# EAGLE design cheapskate_daughter (EAGLE 5.02)
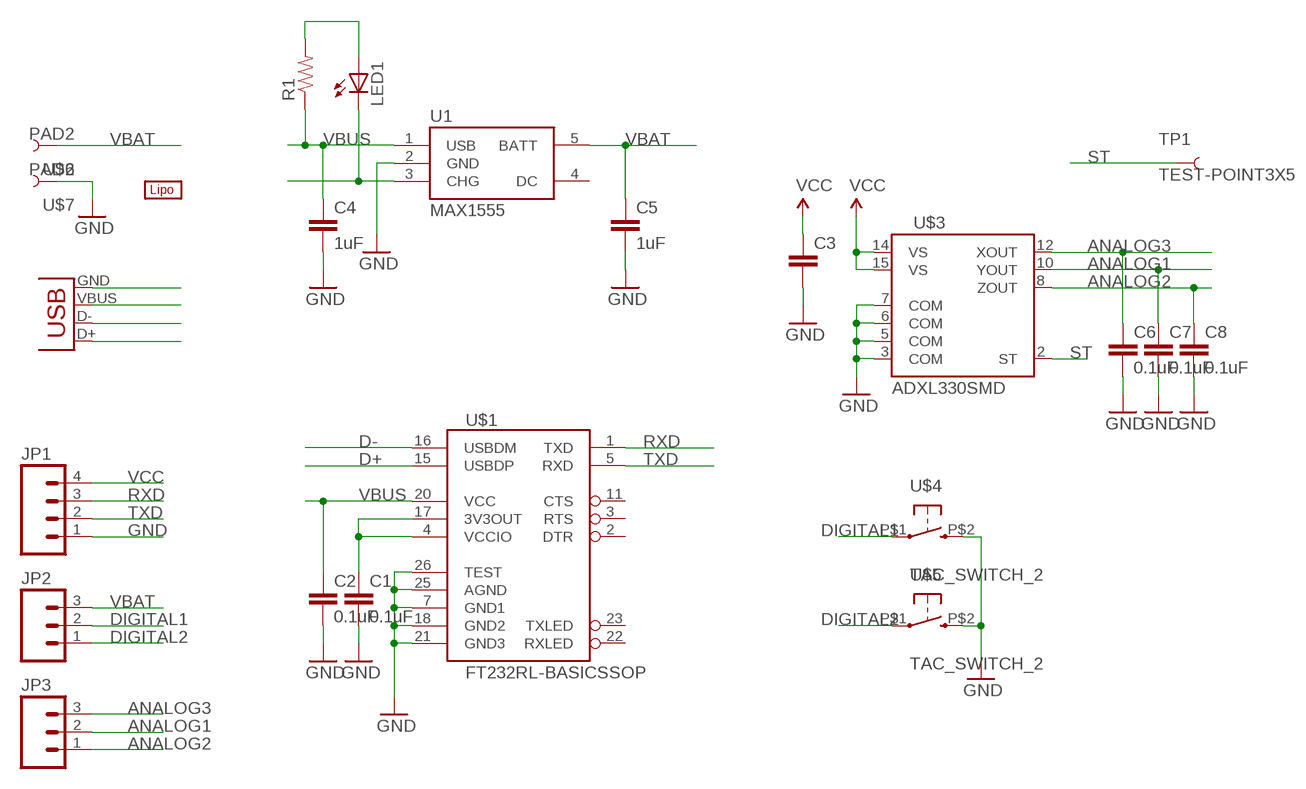
[diagram p0: schematic, sheet 1]

## Parts
C1  0.1uF  CAP0603  [0603]
C2  0.1uF  CAP0603  [0603]
C3  CAP0603  [0603]
C4  1uF  CAP0603  [0603]
C5  1uF  CAP0603  [0603]
C6  0.1uF  CAP0603  [0603]
C7  0.1uF  CAP0603  [0603]
C8  0.1uF  CAP0603  [0603]
JP1  M04PTH  [1X04]
JP2  M03PTH  [1X03]
JP3  M03PTH  [1X03]
LED1  LED0603  [LED-0603]
R1  RESISTOR0603  [0603]
TP1  TEST-POINT3X5  [PAD.03X.05]
U1  MAX1555  [SOT23-5]
U$1  FT232RL-BASICSSOP  [SSOP28DB]
U$2  LIPO-OUTLINE100  [LIPO-100]
U$3  ADXL330SMD  [LFCSP-16]
U$4  TAC_SWITCH_2  [KSS231GLFS]
U$5  TAC_SWITCH_2  [KSS231GLFS]
U$6  PAD2  [PAD-3MMX3MM]
U$7  PAD2  [PAD-3MMX3MM]
X1  USBSMD  [USB-MINIB]

## Nets
ANALOG1: C7.1 JP3.2 U$3.10(YOUT)
ANALOG2: C8.1 JP3.1 U$3.8(ZOUT)
ANALOG3: C6.1 JP3.3 U$3.12(XOUT)
D+: U$1.15(USBDP) X1.D+
D-: U$1.16(USBDM) X1.D-
DIGITAL1: JP2.2 U$4.P$1
DIGITAL2: JP2.1 U$5.P$1
GND: C1.2 C2.2 C3.2 C4.2 C5.2 C6.2 C7.2 C8.2 JP1.1 U1.2(GND) U$1.7(GND1) U$1.18(GND2) U$1.21(GND3) U$1.25(AGND) U$1.26(TEST) U$3.3(COM) U$3.5(COM) U$3.6(COM) U$3.7(COM) U$4.P$2 U$5.P$2 U$7.P$1 X1.GND
N$1: LED1.C U1.3(CHG)
N$2: C1.1 U$1.4(VCCIO) U$1.17(3V3OUT)
N$3: LED1.A R1.2
RXD: JP1.3 U$1.1(TXD)
ST: TP1.P$1 U$3.2(ST)
TXD: JP1.2 U$1.5(RXD)
VBAT: C5.1 JP2.3 U1.5(BATT) U$6.P$1
VBUS: C2.1 C4.1 R1.1 U1.1(USB) U$1.20(VCC) X1.VBUS
VCC: C3.1 JP1.4 U$3.14(VS) U$3.15(VS)
Unconnected: U1.4(DC) U$1.2(DTR) U$1.3(RTS) U$1.11(CTS) U$1.22(RXLED) U$1.23(TXLED)

## Library data of the parts
C1-C8 = SparkFun:CAP: Capacitor Standard 0603 ceramic capacitor, and 0.1" leaded capacitor.
JP1 = SparkFun:M04: Header 4 Standard 4-pin 0.1" header. Use with straight break away headers (SKU : PRT-00116), right angle break away headers (PRT-00553), swiss pins (PRT-00743), machine pins (PRT-00117), and female headers (PRT-00115). Molex polarized connector foot print use with SKU : PRT-08231 with associated crimp pins and housings.
JP2 JP3 = SparkFun:M03: Header 3 Standard 3-pin 0.1" header. Use with straight break away headers (SKU : PRT-00116), right angle break away headers (PRT-00553), swiss pins (PRT-00743), machine pins (PRT-00117), and female headers (PRT-00115). Molex polarized connector foot print use with SKU : PRT-08232 with associated crimp pins and housings.
LED1 = SparkFun:LED: LEDs Standard schematic elements and footprints for 5mm, 3mm, 1206, and 0603 sized LEDs. 5mm - Spark Fun Electronics SKU : COM-00529 (and others)
R1 = SparkFun:RESISTOR: Resistor Basic schematic elements and footprints for 0603, 1206, and PTH 1/10th watt (small) resistors.
TP1 = SparkFun:TEST-POINT
U1 = SparkFun:MAX1555: MAX1555 Lithium Charger IC SOT-23 Lithium Polymer charging IC. Schematic element and footprint proven. Spark Fun Electronics SKU : COM-00674
U$1 = SparkFun:FT232RL-BASIC: USB UART This is the simplified version of the FT232RL unit. Only what you need, nothing you don't. Spark Fun Electronics SKU : COM-00650
U$2 = SparkFun:LIPO-OUTLINE
U$3 = SparkFun:ADXL330: Triple Axis Accelerometer Analog Devices ADXL330 +/-3g 2.4V-5.25V Analog output. Spark Fun Electronics SKU : COM-00730. Center pad paste layer has been reduced to avoid shorting.
U$4 U$5 = john:TAC_SWITCH_2
U$6 U$7 = john:PAD2
X1 = SparkFun:USB: USB Connectors USB-B-PTH is fully proven SKU : PRT-00139 USB-miniB is fully proven SKU : PRT-00587 USB-A-PCB is untested. USB-A-H is throughly reviewed, but untested. Spark Fun Electronics SKU : PRT-00437 USB-B-SMT is throughly reviewed, but untested. Needs silkscreen touching up. USB-A-S has not been used/tested USB-MB-H has not been used/tested

## Board
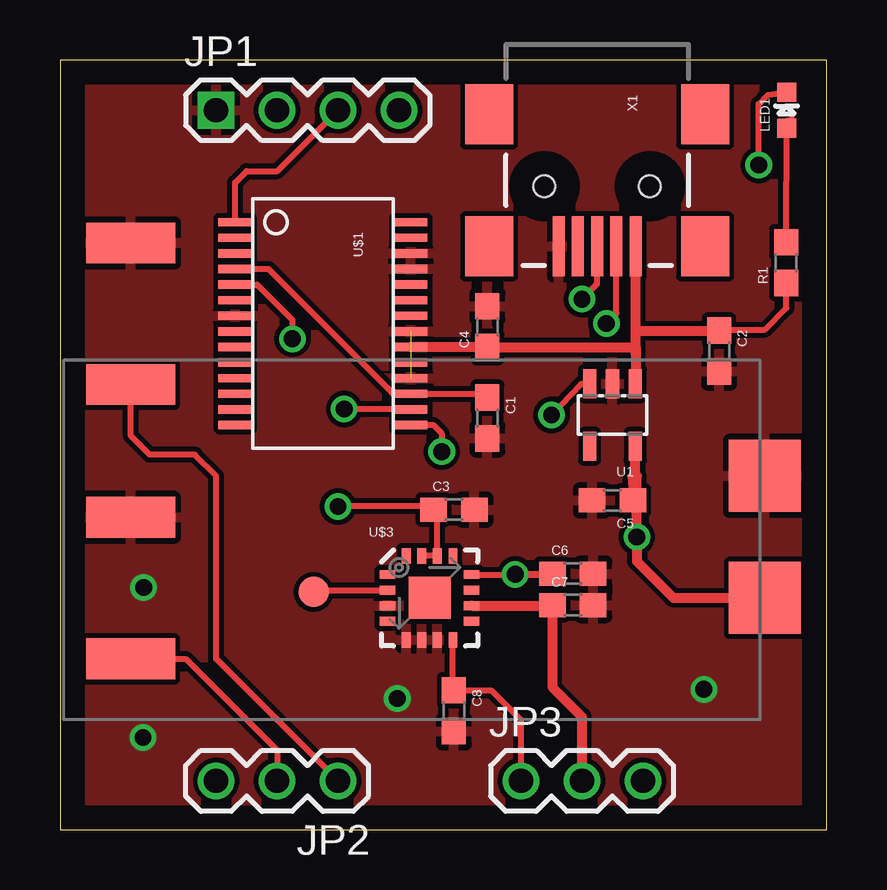
[diagram p1: board, top side]
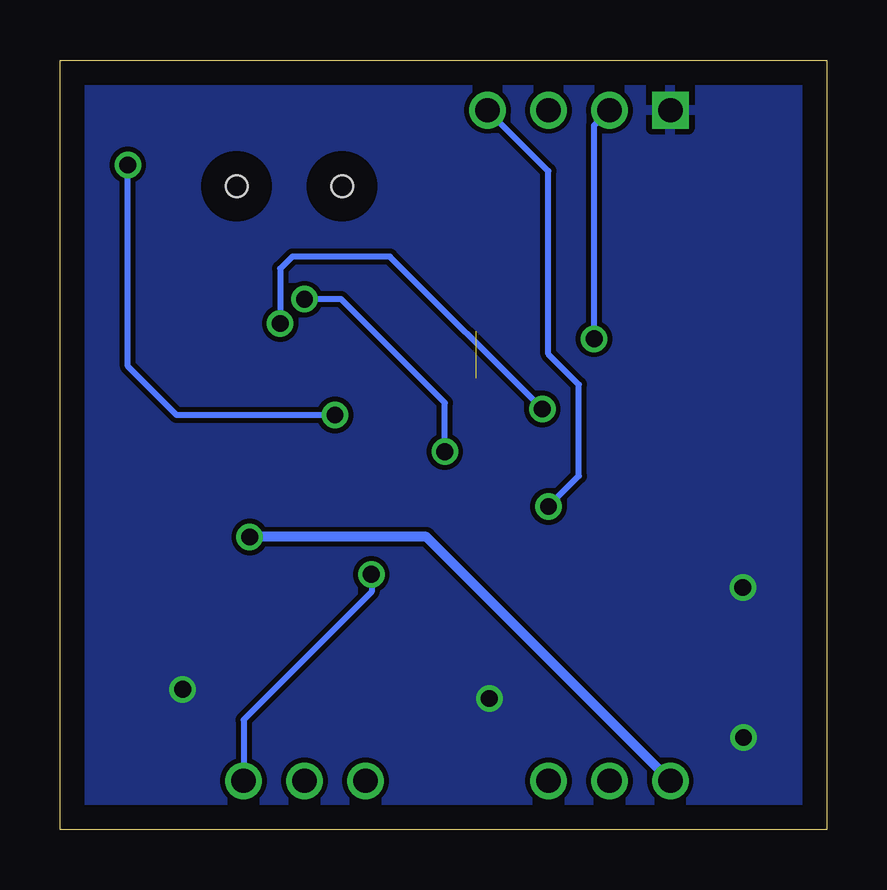
[diagram p2: board, bottom side, seen from below]

Size 31.94 x 32.08 mm. Coordinates in mm from the lower left corner, seen from the top.
Outline: 0,0 31.94,0 31.94,32.08 0,32.08 0,0
Copper layers (1*16): Top 0.035mm / dielectric 1.5mm / Bottom 0.035mm
Design rules "default": minimum track width 10mil, minimum drill 24mil, track to track 8mil, track to pad 8mil, pad to pad 8mil, via to via 8mil, smd to smd 8mil, copper to edge 40mil, drill to drill 8mil, minimum pad ring 10mil, minimum via ring 8mil, stop-mask expansion 4mil, vias tented up to drill 0mil, thermal gap 10mil

### Footprints (pad centres in the part's own frame; a part is rotated, then mirrored left to right if it is on the bottom)
0603 = smd 1.1 x 1: 1 -0.85,0; 2 0.85,0
1X04 = drill 1.016 square: 1 0,0 | drill 1.016 round: 2 2.54,0; 3 5.08,0; 4 7.62,0
1X03 = drill 1.016 round: 1 0,0; 2 2.54,0; 3 5.08,0
LED-0603 = smd 0.8 x 0.8: A 0,-0.75; C 0,0.75
PAD.03X.05 = smd 1.27 x 1.27: P$1 0,0
SOT23-5 = smd 0.55 x 1.2: 1 -0.95,-1.3; 2 0,-1.3; 3 0.95,-1.3; 4 0.95,1.3; 5 -0.95,1.3
SSOP28DB = smd 0.348 x 1.397: 1 -4.225,-3.656; 2 -3.575,-3.656; 3 -2.925,-3.656; 4 -2.275,-3.656; 5 -1.625,-3.656; 6 -0.975,-3.656; 7 -0.325,-3.656; 8 0.325,-3.656; 9 0.975,-3.656; 10 1.625,-3.656; 11 2.275,-3.656; 12 2.925,-3.656; 13 3.575,-3.656; 14 4.225,-3.656; 15 4.225,3.656; 16 3.575,3.656; 17 2.925,3.656; 18 2.275,3.656; 19 1.625,3.656; 20 0.975,3.656; 21 0.325,3.656; 22 -0.325,3.656; 23 -0.975,3.656; 24 -1.625,3.656; 25 -2.275,3.656; 26 -2.925,3.656; 27 -3.575,3.656; 28 -4.225,3.656
LFCSP-16 = smd 1.75 x 1.75: 0 0,0 | smd 0.65 x 0.37: 1 -1.75,0.975; 2 -1.75,0.325; 3 -1.75,-0.325; 4 -1.75,-0.975; 9 1.75,-0.975; 10 1.75,-0.325; 11 1.75,0.325; 12 1.75,0.975 | smd 0.37 x 0.65: 5 -0.975,-1.75; 6 -0.325,-1.75; 7 0.325,-1.75; 8 0.975,-1.75; 13 0.975,1.75; 14 0.325,1.75; 15 -0.325,1.75; 16 -0.975,1.75
KSS231GLFS = smd 1.7 x 3.7: P$1 0,0; P$2 5.9,0
PAD-3MMX3MM = smd 3 x 3: P$1 0,0
USB-MINIB = smd 2.5 x 0.5: D+ 2.5,0; D- 2.5,0.8; GND 2.5,-1.6; ID 2.5,-0.8; VBUS 2.5,1.6 | smd 2.5 x 2: GND@1 -3,-4.5; GND@2 -3,4.5; GND@3 2.5,4.5; GND@4 2.5,-4.5 | hole 0.9: 0,2.2; 0,-2.2

### Placement (x,y rotation side)
C1  17.81,17.16 270 top
C2  27.46,19.95 270 top
C3  16.41,13.35 0 top
C4  17.81,20.97 90 top
C5  23.02,13.73 180 top
C6  21.37,10.68 0 top
C7  21.37,9.36 0 top
C8  16.41,4.96 270 top
JP1  6.51,29.98 0 top
JP2  11.59,2.04 180 top
JP3  19.21,2.04 0 top
LED1  30.28,29.98 0 top
R1  30.26,23.63 90 top
TP1  10.57,9.92 0 top
U1  23.02,17.28 180 top
U$1  10.95,21.09 270 top
U$2  0.16,4.58 0 top
U$3  15.4,9.66 0 top
U$4  2.95,7.12 90 top
U$5  2.95,18.55 90 top
U$6  29.37,9.66 0 top
U$7  29.37,14.74 0 top
X1  22.38,26.81 270 top

### Tracks (layer width: path | path; a pad name or v marks a point on that pad's centre or on a via)
ANALOG1
  Top 0.406: 20.55,9.36 20.55,9.38 | 20.55,9.36 C7.1 20.52,5.94 21.75,4.71 21.75,2.09 21.77,2.07 JP3.2 | U$3.10 20.55,9.34 20.55,9.36
ANALOG2
  Top 0.254: U$3.8 16.37,5.89 16.41,5.85 C8.1 17.98,5.81 19.21,4.58 JP3.1
ANALOG3  (via drill 0.7)
  Top 0.254: C6.1 20.48,10.68 20.44,10.64 U$3.12 | 20.46,10.64 v18.97,10.64
  Top 0.406: C6.1 20.5,10.68 20.46,10.64
  Bottom 0.254: JP3.3 24.29,4.58 18.95,9.92 v18.97,10.64
D+  (via drill 0.7)
  Top 0.254: X1.D+ 22.38,22.74 v21.75,22.11 | U$1.15 15.56,16.87 15.91,16.52 v15.91,15.76
  Bottom 0.254: v15.91,15.76 15.91,17.79 20.22,22.11 v21.75,22.11
D-  (via drill 0.7)
  Top 0.254: X1.D- 23.18,21.51 v22.76,21.09 | U$1.16 14.64,17.54 v11.84,17.54
  Bottom 0.254: v22.76,21.09 22.76,23.38 22.26,23.89 18.19,23.89 v11.84,17.54
DIGITAL1
  Top 0.254: JP2.2 9.05,3.31 5.24,7.12 U$4.P$1
DIGITAL2
  Top 0.254: JP2.1 6.51,7.12 6.51,14.74 5.62,15.63 3.74,15.63 2.95,16.42 U$5.P$1
GND  (via drill 0.7)  (1 unrouted)
  other vias: 3.48,10.09 14.05,5.47 26.83,5.85 3.46,3.85
  pour Top: 0.03,32.01 0.03,0.01 31.91,0.01 31.91,32.01
  pour Bottom: 0.16,32.01 31.65,32.01 31.65,0.26 0.16,0.26
N$1  (via drill 0.7)
  Top 0.254: U1.3 21.72,18.58 v20.48,17.28 | LED1.C 29.49,30.62 29.11,30.24 v29.11,27.7
  Bottom 0.254: v20.48,17.28 27.08,17.28 29.11,19.31 v29.11,27.7
N$2
  Top 0.254: U$1.4 8.68,23.37 13.88,18.17 U$1.17 17.81,18.17 | 17.81,18.17 17.94,18.3 | 17.81,18.17 C1.1
N$3
  Top 0.254: LED1.A 30.5,29.61 30.28,29.54 R1.2
RXD
  Top 0.254: U$1.1 7.3,26.96 7.78,27.44 9.05,27.44 JP1.3
ST
  Top 0.254: U$3.2 10.64,9.99 TP1.P$1
TXD  (via drill 0.7)
  Top 0.254: U$1.5 8.21,22.72 9.68,21.25 v9.68,20.46
  Bottom 0.254: v9.68,20.46 9.68,29.35 JP1.2
VBAT  (via drill 0.7)
  Top 0.254: 23.97,14.93 23.78,14.74 C5.1 24.03,14.74
  Top 0.406: 23.97,14.93 U1.5 | 24.03,14.74 v24.03,12.2 24.03,11.19 25.56,9.66 U$6.P$1
  Bottom 0.406: v24.03,12.2 16.67,12.2 JP2.3
VBUS
  Top 0.254: 23.98,19.87 23.98,19.85 24.03,19.82 | 30.64,22.87 R1.1 30.26,21.75 29.37,20.84 27.59,20.84 27.55,20.8 C2.1 | 23.98,20.84 24.03,20.84 24.07,20.8
  Top 0.406: 23.98,20.13 23.98,19.87 | 23.98,20.13 23.98,20.84 X1.VBUS | 24.07,20.8 C2.1 | 23.98,18.58 U1.1 | 23.98,19.85 23.98,18.58 | 23.98,18.58 24.03,18.55 | 17.91,20.12 17.91,20.11 | 17.91,20.12 C4.1 23.97,20.12 23.96,20.13 23.98,20.13 | U$1.20 17.9,20.12 17.91,20.12
VCC  (via drill 0.7)
  Top 0.254: v11.59,13.47 15.44,13.47 C3.1 15.56,13.38 15.65,13.47 15.72,13.4 U$3.14 15.68,11.41 15.65,11.44 15.62,11.41 U$3.15
  Bottom 0.254: JP1.4 11.59,27.44 11.59,19.82 10.32,18.55 10.32,14.74 v11.59,13.47